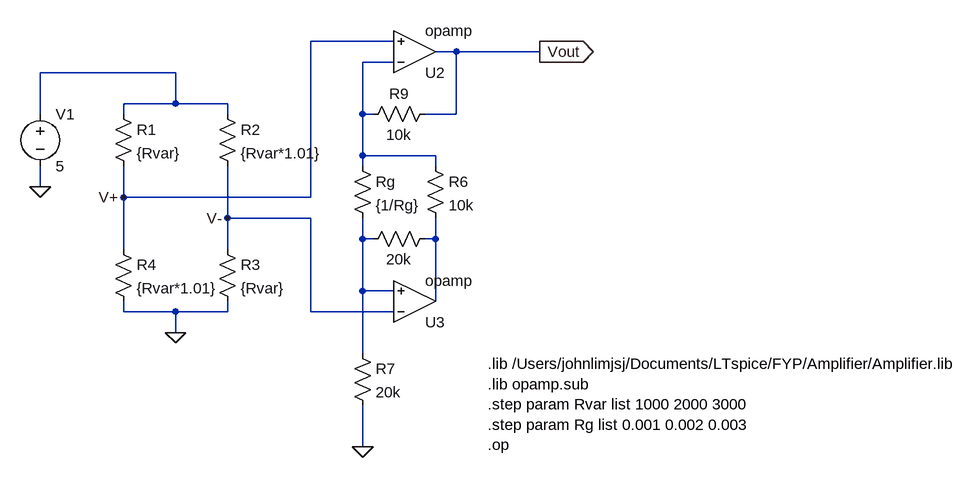
[diagram p0: schematic InstrumentationOpAmp.asc]
InstrumentationOpAmp.asc, the LTspice schematic file:
Version 4
SHEET 1 1460 688
WIRE 576 48 448 48
WIRE 672 64 640 64
WIRE 800 64 672 64
WIRE 576 80 528 80
WIRE 240 96 32 96
WIRE 240 144 240 96
WIRE 240 144 160 144
WIRE 320 144 240 144
WIRE 32 160 32 96
WIRE 160 160 160 144
WIRE 320 160 320 144
WIRE 528 160 528 80
WIRE 544 160 528 160
WIRE 672 160 672 64
WIRE 672 160 624 160
WIRE 528 224 528 160
WIRE 640 224 528 224
WIRE 528 240 528 224
WIRE 640 240 640 224
WIRE 32 272 32 240
WIRE 160 288 160 240
WIRE 448 288 448 48
WIRE 448 288 160 288
WIRE 320 320 320 240
WIRE 448 320 320 320
WIRE 528 352 528 320
WIRE 544 352 528 352
WIRE 640 352 640 320
WIRE 640 352 624 352
WIRE 160 368 160 288
WIRE 320 368 320 320
WIRE 528 432 528 352
WIRE 576 432 528 432
WIRE 640 448 640 352
WIRE 160 464 160 448
WIRE 240 464 160 464
WIRE 320 464 320 448
WIRE 320 464 240 464
WIRE 448 464 448 320
WIRE 576 464 448 464
WIRE 240 496 240 464
WIRE 528 528 528 432
WIRE 528 672 528 608
FLAG 32 272 0
FLAG 240 496 0
FLAG 160 288 V+
FLAG 320 320 V-
FLAG 528 672 0
FLAG 800 64 Vout
IOPIN 800 64 Out
SYMBOL res 144 144 R0
SYMATTR InstName R1
SYMATTR Value {Rvar}
SYMBOL res 304 144 R0
SYMATTR InstName R2
SYMATTR Value {Rvar*1.01}
SYMBOL res 304 352 R0
SYMATTR InstName R3
SYMATTR Value {Rvar}
SYMBOL res 144 352 R0
SYMATTR InstName R4
SYMATTR Value {Rvar*1.01}
SYMBOL voltage 32 144 R0
SYMATTR InstName V1
SYMATTR Value 5
SYMBOL Opamps/opamp 608 128 M180
SYMATTR InstName U2
SYMBOL Opamps/opamp 608 512 M180
SYMATTR InstName U3
SYMBOL res 512 224 R0
SYMATTR InstName Rg
SYMATTR Value {1/Rg}
SYMBOL res 624 224 R0
SYMATTR InstName R6
SYMATTR Value 10k
SYMBOL res 512 512 R0
SYMATTR InstName R7
SYMATTR Value 20k
SYMBOL res 640 336 R90
WINDOW 0 0 56 Invisible 2
WINDOW 3 32 56 VTop 2
SYMATTR InstName R8
SYMATTR Value 20k
SYMBOL res 640 144 R90
WINDOW 0 0 56 VBottom 2
WINDOW 3 32 56 VTop 2
SYMATTR InstName R9
SYMATTR Value 10k
TEXT 720 544 Left 2 !.lib /Users/johnlimjsj/Documents/LTspice/FYP/Amplifier/Amplifier.lib\n.lib opamp.sub\n.step param Rvar list 1000 2000 3000\n.step param Rg list 0.001 0.002 0.003\n.op

The netlist it stands for:
* InstrumentationOpAmp.asc
R1 N002 V+ {Rvar}
R2 N002 V- {Rvar*1.01}
R3 V- 0 {Rvar}
R4 V+ 0 {Rvar*1.01}
V1 N002 0 5
XU2 N001 V+ Vout opamp Aol=100K GBW=10Meg  ; pins invin noninvin out
XU3 V- N003 N004 opamp Aol=100K GBW=10Meg  ; pins invin noninvin out
Rg N001 N003 {1/Rg}
R6 N001 N004 10k
R7 N003 0 20k
R8 N004 N003 20k
R9 Vout N001 10k
.lib /Users/johnlimjsj/Documents/LTspice/FYP/Amplifier/Amplifier.lib
.lib opamp.sub
.step param Rvar list 1000 2000 3000
.step param Rg list 0.001 0.002 0.003
.op
.backanno
.end